# EAGLE design Core-Locobuffer (EAGLE 7.7.0)
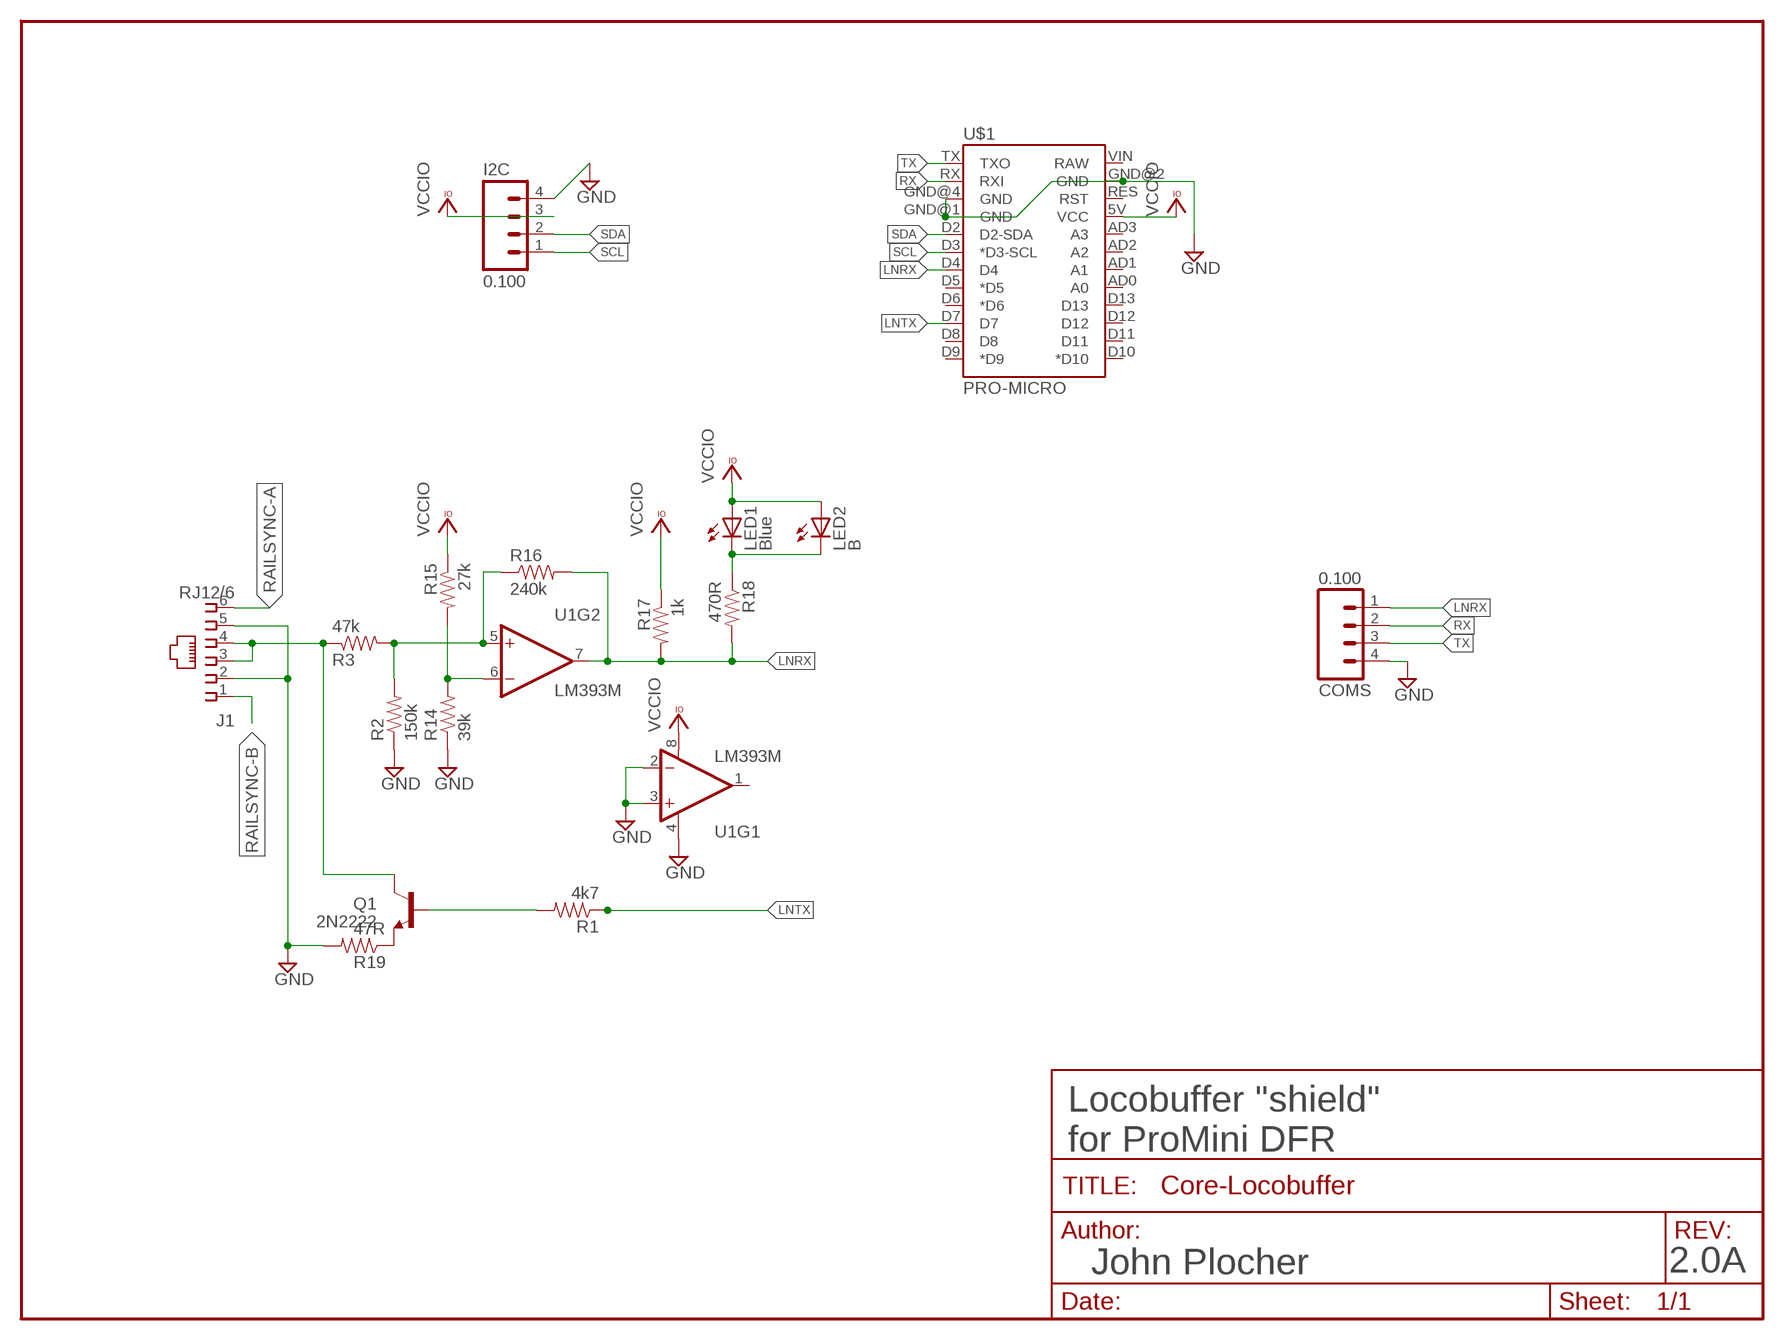
[diagram p0: schematic, sheet 1]

## Parts
COMS  0.100  CONNECTOR-M04LOCK  [1X04_LOCK]
I2C  0.100  CONNECTOR-M04LOCK  [1X04_LOCK]
J1  RJ12/6  CONNECTOR-RJ25-6P6C  [RJ25-PANEL]
LED1  Blue  LED0603-LED  [0603-LED]
LED2  B  LEDLED5MM  [LED5MM]
Q1  2N2222  NPN-SOT23  [SOT23]
R1  4k7  R0603-RES  [0603-RES]
R2  150k  R0603-RES  [0603-RES]
R3  47k  R0603-RES  [0603-RES]
R14  39k  R0603-RES  [0603-RES]
R15  27k  R0603-RES  [0603-RES]
R16  240k  R0603-RES  [0603-RES]
R17  1k  R0603-RES  [0603-RES]
R18  470R  R0603-RES  [0603-RES]
R19  47R  R0603-RES  [0603-RES]
U1  LM393M  [SO08]
U$1  PRO-MICRO  ARDUINO-PRO-MICRO  [ARDUINO-PRO-MICRO-NOSILK]

## Nets
GND [Power]: COMS.4 I2C.4 J1.2 J1.5 R2.1 R14.1 R19.2 U1.2(-IN) U1.3(+IN) U1.4(V-) U$1.GND@1(GND) U$1.GND@2(GND) U$1.GND@4(GND)
LNRX: COMS.1 R16.2 R17.2 R18.2 U1.7(OUT) U$1.D4
LNTX: R1.1 U$1.D7
LOCONET [Power]: J1.3 J1.4 Q1.3(C) R3.1
N$1: Q1.1(B) R1.2
N$2: LED1.C LED2.K(C) R18.1
N$4: R2.2 R3.2 R16.1 U1.5(+IN)
N$5: R14.2 R15.2 U1.6(-IN)
N$11: Q1.2(E) R19.1
RAILSYNC-A: J1.6
RAILSYNC-B: J1.1
RX [signals]: COMS.2 U$1.RX(RXI)
SCL: I2C.1 U$1.D3(*D3-SCL)
SDA: I2C.2 U$1.D2(D2-SDA)
TX [signals]: COMS.3 U$1.TX(TXO)
VCCIO: I2C.3 LED1.A LED2.A R15.1 R17.1 U1.8(V+) U$1.5V(VCC)
Unconnected: U1.1(OUT) U$1.AD0(A0) U$1.AD1(A1) U$1.AD2(A2) U$1.AD3(A3) U$1.D5(*D5) U$1.D6(*D6) U$1.D8 U$1.D9(*D9) U$1.D10(*D10) U$1.D11 U$1.D12 U$1.D13 U$1.RES(RST) U$1.VIN(RAW)

## Notes on the sheet
- Locobuffer "shield"
  for ProMini DFR
- John Plocher | 2.0A

## Library data of the parts
COMS I2C = SPCoast:CONNECTOR-M04: Header 4 Standard 4-pin 0.1" header. Use with straight break away headers (SKU : PRT-00116), right angle break away headers (PRT-00553), swiss pins (PRT-00743), machine pins (PRT-00117), and female headers (PRT-00115). Molex polarized connector foot print use with SKU : PRT-08231 with associated crimp pins and housings. 1MM SMD Version SKU: PRT-10208
J1 = SPCoast:CONNECTOR-RJ25: AMP connector; AMP: 520250-3; OPL: none
LED1 LED2 = SPCoast:LED*
Q1 = SPCoast:NPN: Transistor NPN BJT configuration in SOT23 package. MMBT2222 is the common NPN we use. Double check BCE configuration again layout.
R1-R3 R14-R19 = SPCoast:R*: Resistor Basic schematic elements and footprints for 0603, 1206, and PTH 1/10th watt (small) resistors.
U1 = SPCoast:LM393
U$1 = SPCoast:ARDUINO-PRO-MICRO

## Net classes
0 default: width 0.203 mm, drill 0.5 mm
1 Power: width 0.305 mm, drill 0.6 mm
2 signals: width 0.254 mm, drill 0.5 mm

## Board
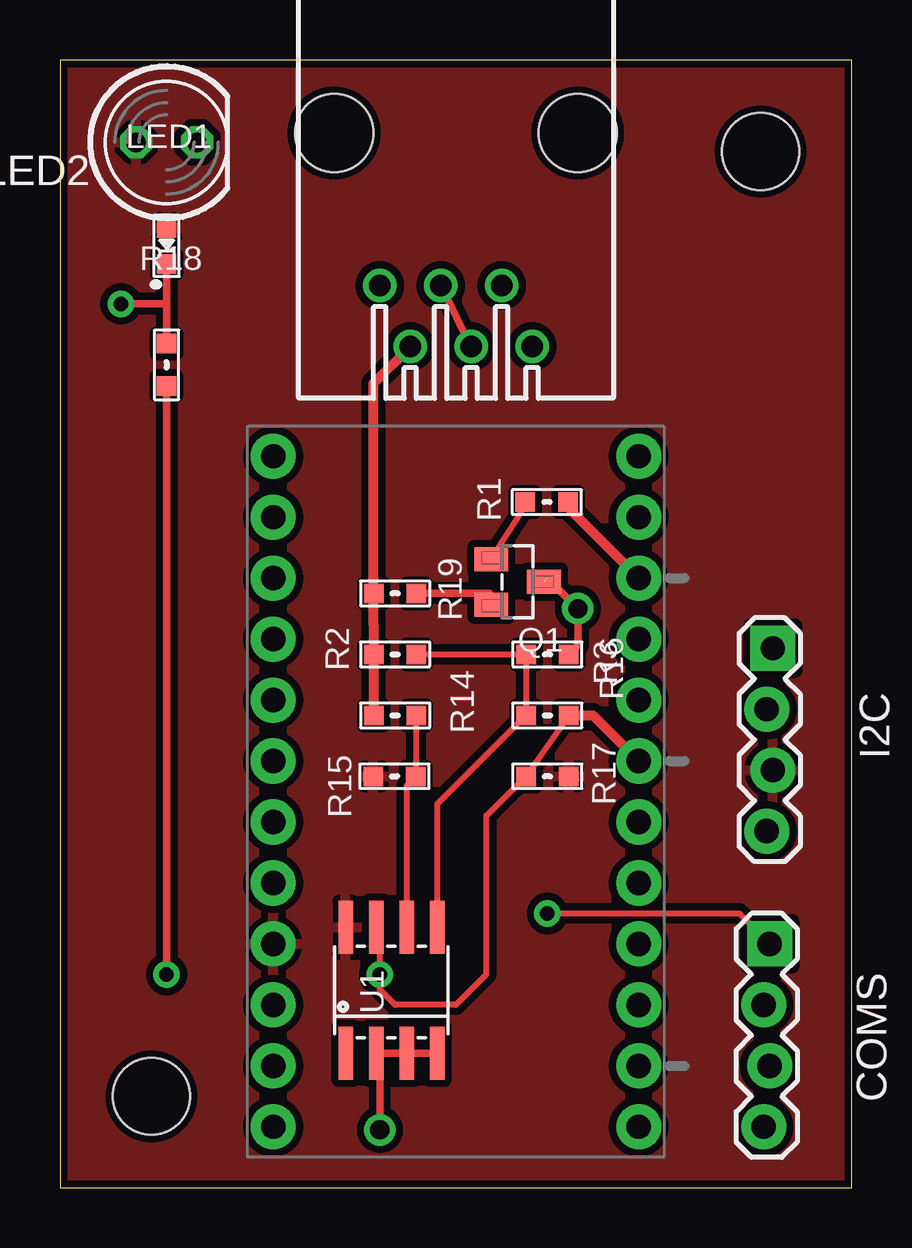
[diagram p1: board, top side]
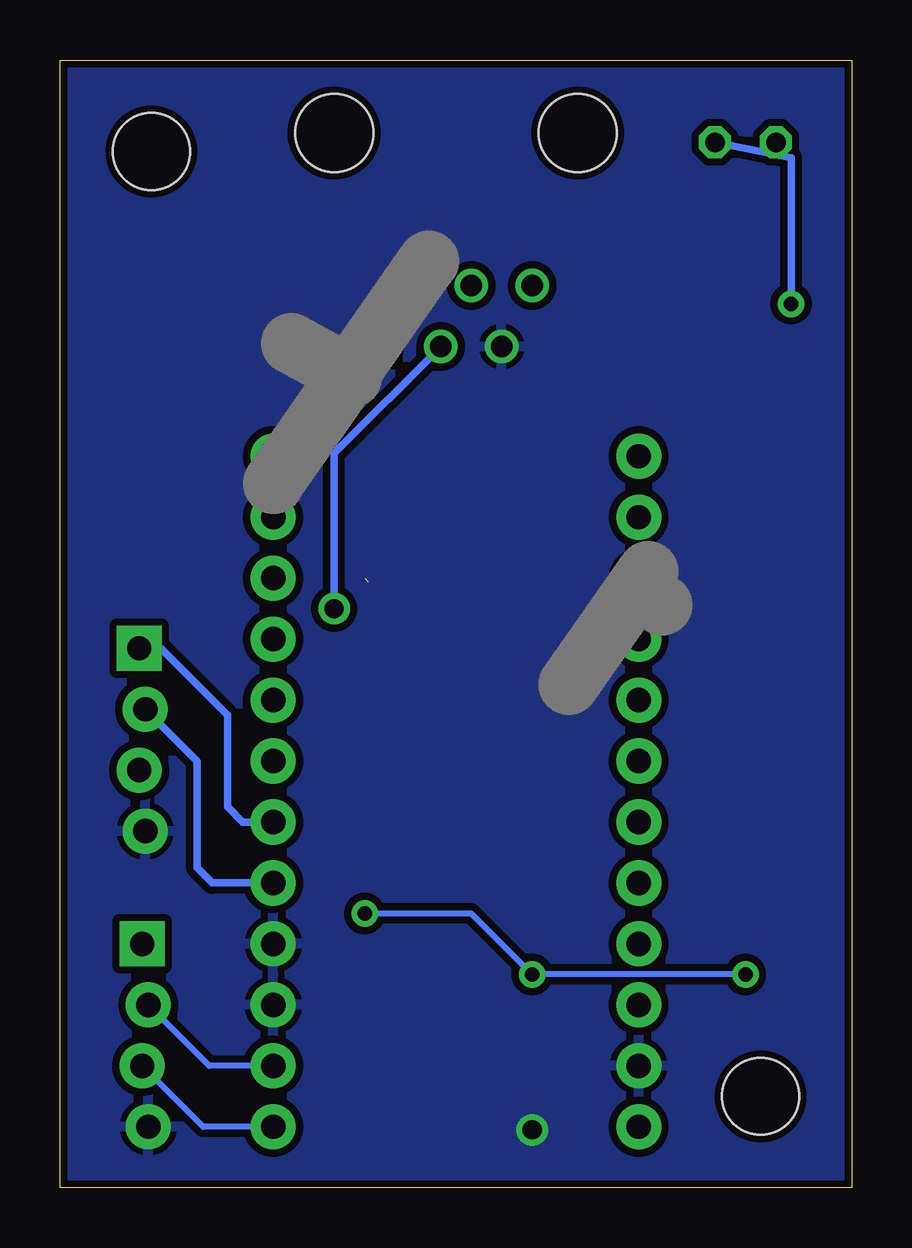
[diagram p2: board, bottom side, seen from below]

Size 33.02 x 46.99 mm. Coordinates in mm from the lower left corner, seen from the top.
Outline: 0,46.99 0,0 33.02,0 33.02,46.99 0,46.99
Copper layers (1*16): Top 0.035mm / dielectric 1.5mm / Bottom 0.035mm
Design rules "Fusion_eagle_rule_v1.1 *": minimum track width 8mil, minimum drill 0.6mm, track to track 6mil, track to pad 6mil, pad to pad 10mil, via to via 10mil, smd to smd 10mil, copper to edge 10mil, drill to drill 10mil, minimum pad ring 10mil, minimum via ring 10mil, stop-mask expansion 2mil, vias tented up to drill 100mil, thermal gap 10mil
Holes 3.2 mm at 3.81,3.81 29.21,43.18

### Footprints (pad centres in the part's own frame; a part is rotated, then mirrored left to right if it is on the bottom)
1X04_LOCK = drill 1.016 pad 1.88 square: 1 0,0.127 | drill 1.016 pad 1.88: 2 2.54,-0.127; 3 5.08,0.127; 4 7.62,-0.127
RJ25-PANEL = drill 0.889: 1 -3.175,8.89; 2 -1.905,6.35; 3 -0.635,8.89; 4 0.635,6.35; 5 1.905,8.89; 6 3.175,6.35 | hole 3.251: -5.08,0; 5.08,0
0603-LED = smd 0.8 x 0.8: A 0.75,0; C -0.75,0
LED5MM = drill 0.813 octagon: A 1.27,0; K -1.27,0
SOT23 = smd 1.4 x 1: 1 1.1,-0.95; 2 1.1,0.95; 3 -1.1,0
0603-RES = smd 0.813 x 0.813: 1 -0.889,0; 2 0.889,0
SO08 = smd 0.61 x 2.21: 1 -1.905,-2.616; 2 -0.635,-2.616; 3 0.635,-2.616; 4 1.905,-2.616; 5 1.905,2.616; 6 0.635,2.616; 7 -0.635,2.616; 8 -1.905,2.616
ARDUINO-PRO-MICRO-NOSILK = drill 1.016 pad 1.88: 5V 7.62,5.08; AD0 7.62,-5.08; AD1 7.62,-2.54; AD2 7.62,0; AD3 7.62,2.54; D2 -7.62,2.54; D3 -7.62,0; D4 -7.62,-2.54; D5 -7.62,-5.08; D6 -7.62,-7.62; D7 -7.62,-10.16; D8 -7.62,-12.7; D9 -7.62,-15.24; D10 7.62,-15.24; D11 7.62,-12.7; D12 7.62,-10.16; D13 7.62,-7.62; GND@1 7.62,10.16; GND@2 -7.62,7.62; GND@4 -7.62,5.08; RES 7.62,7.62; RX -7.62,10.16; TX -7.62,12.7; VIN 7.62,12.7

### Placement (x,y rotation side)
COMS  29.46,10.16 270 top
I2C  29.59,22.48 270 top
J1  16.51,43.94 180 top
LED1  4.45,39.24 90 top
LED2  4.45,43.56 180 top
Q1  19.08,25.25 180 top
R1  20.29,28.57 180 top
R2  13.97,22.23 0 top
R3  20.32,22.23 180 top
R14  13.97,19.68 0 top
R15  13.94,17.14 0 top
R16  20.32,19.68 0 top
R17  20.32,17.14 180 top
R18  4.45,34.29 270 top
R19  13.97,24.77 180 top
U1  13.82,8.23 0 top
U$1  16.51,15.24 180 top

### Tracks (layer width: path | path; a pad name or v marks a point on that pad's centre or on a via)
GND  (via drill 0.8)
  Top 0.305: U1.4 U1.3 U1.2 13.34,5 v13.34,2.41
  Top 0.406: R14.1 R2.1 13.07,23.5 R19.2 13.07,25.77 13.07,33.52 J1.5
  pour Bottom (isolate 0.305, rank 2): 33.02,0 33.02,46.99 0,46.99 0,0
LNRX  (via drill 0.6)
  Top 0.254: R16.2 R17.2 17.78,15.51 17.78,8.89 16.51,7.62 13.97,7.62 13.34,8.26 v13.34,8.89 13.34,10.69 U1.7 | v20.32,11.43 28.32,11.43 COMS.1
  Top 0.305: R18.2 v4.45,8.89
  Top 0.406: R16.2 22.23,19.68 U$1.D4
  Bottom 0.254: v4.45,8.89 v13.34,8.89 15.88,11.43 v20.32,11.43
LNTX
  Top 0.254: R1.1 21.2,28.34
  Top 0.406: 21.2,28.34 U$1.D7
LOCONET  (via drill 0.8)  (1 unrouted)
  Top 0.305: 20.3,25.4 20.32,25.4 v21.59,24.13 21.59,22.59 R3.1 | J1.4 J1.3
  Bottom 0.305: v21.59,24.13 21.59,30.61 J1.3
N$1
  Top 0.254: Q1.1 19.47,28.5 R1.2
N$2  (via drill 0.6)
  Top 0.305: LED1.C 4.45,36.77 | 4.45,36.77 R18.1 | 4.45,36.77 4.39,36.83 v2.54,36.83
  Bottom 0.305: v2.54,36.83 2.54,42.93 LED2.K
N$4
  Top 0.254: R2.2 R3.2 R16.1 15.72,15.99 U1.5
N$5
  Top 0.254: R14.2 14.85,19.66 R15.2 14.45,16.75 U1.6
N$11
  Top 0.305: Q1.2 17.91,24.77 R19.1
RX
  Bottom 0.254: U$1.RX 26.8,5.08 COMS.2
SCL
  Bottom 0.305: U$1.D3 25.4,15.24 26.04,15.88 26.04,19.68 28.83,22.48 I2C.1
SDA
  Bottom 0.305: U$1.D2 26.67,12.7 27.3,13.34 27.3,17.78 I2C.2
TX
  Bottom 0.254: U$1.TX 27.05,2.54 COMS.3
VCCIO
  pour Top (isolate 0.305, rank 2): 33.02,0 33.02,46.99 0,46.99 0,0

### Text on the board
tDocu: 2017-11 | John / Plocher | Activity | To Lnet | v2.1 | Core / Locobuffer | I2C | LNTX | LNRX | G + D C | * | G Tx Rx LnRx
bDocu: Made in the PCR, Coast Division, NMRA | Model Railroading / is fun! | Go Bears! | www. SP Coast .com | For use with Pro Micro / 32u4 version | Core-Locobuffer